# EAGLE design TSOC_CYBLE022 (EAGLE 6.6.0)
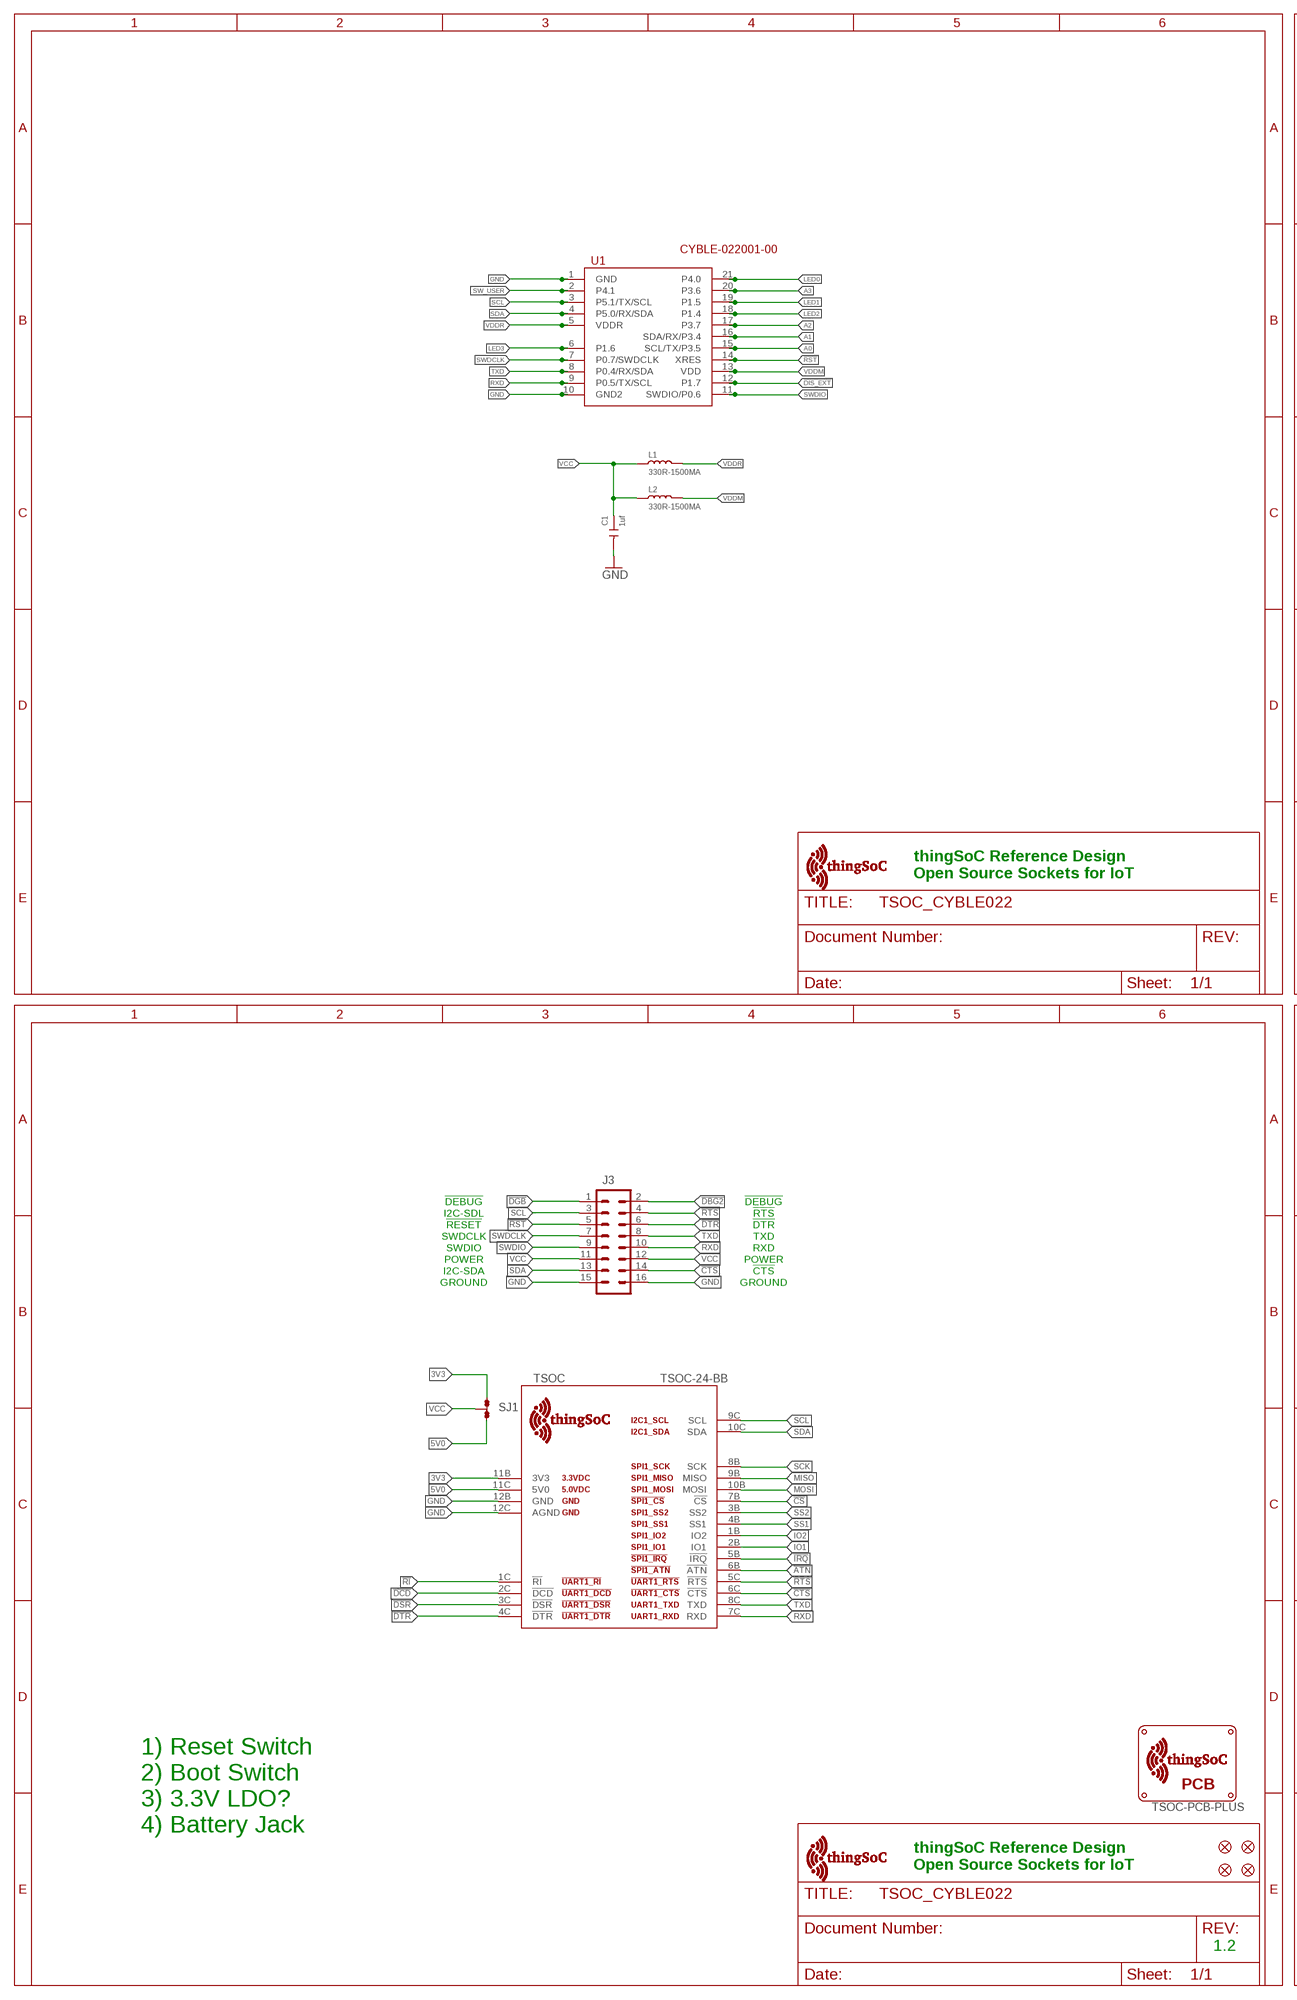
[diagram p0: schematic, sheet 1, part 1 of 2]
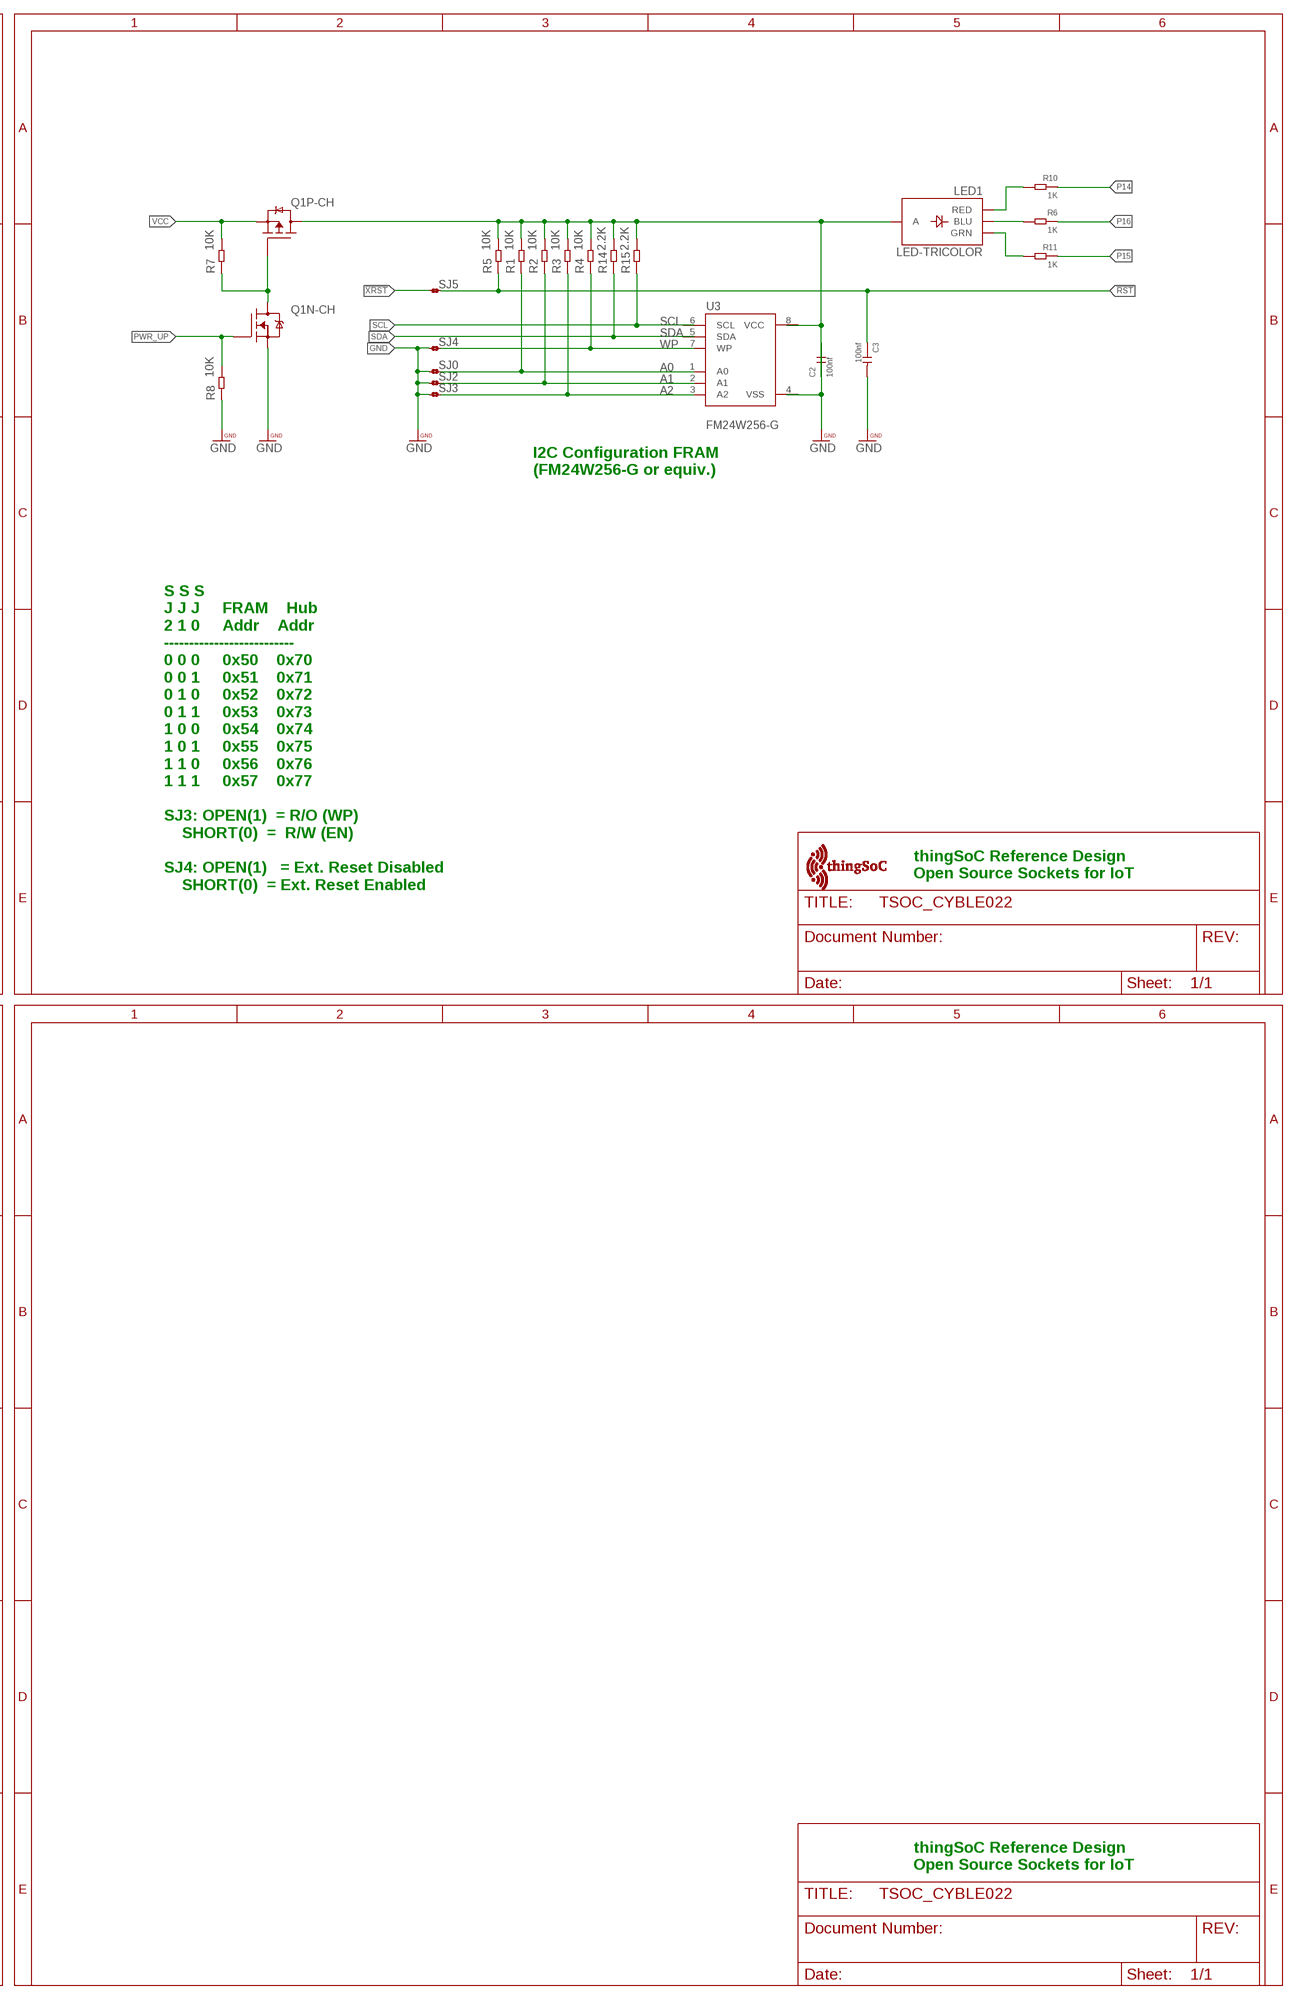
[diagram p1: schematic, sheet 1, part 2 of 2]

## Parts
$$U$4  TSOC-LOGO-SMALL  [TSOC-LOGO-SML]
C1  1uf  CERAMIC-1UF-25V-10%-X7R(0603)  [C0603]
C2  100nf  CERAMIC-100NF-50V-10%-X7R(0603)  [C0603]
C3  100nf  CERAMIC-100NF-50V-10%-X7R(0603)  [C0603]
FID1  FIDUCIALUFIDUCIAL  [MICRO-FIDUCIAL]
FID2  FIDUCIALUFIDUCIAL  [MICRO-FIDUCIAL]
FID3  FIDUCIALUFIDUCIAL  [MICRO-FIDUCIAL]
FID4  FIDUCIALUFIDUCIAL  [MICRO-FIDUCIAL]
J3  M08X2  [2X8]
L1  330R-1500MA  SMD-FERRITE-BEAD-330R-1500MA(0805)'0805'  [L0805]
L2  330R-1500MA  SMD-FERRITE-BEAD-330R-1500MA(0805)'0805'  [L0805]
LED1  LED-TRICOLOR  [LED-TRICOLOR-SMD]
Q1  FDC6420C  [SOT95P280X110-6N]
R1  10K  SMD-RES-10K-1%-1/10W(0603)  [R0603]
R2  10K  SMD-RES-10K-1%-1/10W(0603)  [R0603]
R3  10K  SMD-RES-10K-1%-1/10W(0603)  [R0603]
R4  10K  SMD-RES-10K-1%-1/10W(0603)  [R0603]
R5  10K  SMD-RES-10K-1%-1/10W(0603)  [R0603]
R6  1K  SMD-RES-1K-1%-1/10W(0603)  [R0603]
R7  10K  SMD-RES-10K-1%-1/10W(0603)  [R0603]
R8  10K  SMD-RES-10K-1%-1/10W(0603)  [R0603]
R10  1K  SMD-RES-1K-1%-1/10W(0603)  [R0603]
R11  1K  SMD-RES-1K-1%-1/10W(0603)  [R0603]
R14  2.2K  SMD-RES-2.2K-5%-1/10W(0603)  [R0603]
R15  2.2K  SMD-RES-2.2K-5%-1/10W(0603)  [R0603]
SJ0  JMP-2-NO  [JMP-2-NO]
SJ1  JMP-3-NC  [JMP-3-NC]
SJ2  JMP-2-NO  [JMP-2-NO]
SJ3  JMP-2-NO  [JMP-2-NO]
SJ4  JMP-2-NO  [JMP-2-NO]
SJ5  JMP-2-NO  [JMP-2-NO]
TSOC  TSOC-24-BB  [TSOC-BB-S24]
U1  CYBLE-022001-00  [PROC-BLE-10MM-21]
U3  FM24W256-G  [SO08]
U$1  TSOC-PCB-PLUS  [TSOC-BB-BRD-PLUS-DIM]
U$100  TSOC-LOGO-SMALL  [TSOC-LOGO-SML]
U$101  TSOC-LOGO-LRG  [TSOC-LOGO-LRG]

## Nets
3V3: SJ1.1 TSOC.11B(3V3)
5V0: SJ1.3 TSOC.11C(5V0)
!ATN: TSOC.6B(!ATN)
!CS: TSOC.7B(!CS)
!CTS: J3.14 TSOC.6C(!CTS)
!DBG2: J3.2
!DCD: TSOC.2C(!DCD)
!DGB: J3.1
!DIS_EXT: U1.12(P1.7)
!DSR: TSOC.3C(!DSR)
!DTR: J3.6 TSOC.4C(!DTR)
!IRQ: TSOC.5B(!IRQ)
!RI: TSOC.1C(!RI)
!RST: C3.1 J3.5 R5.1 SJ5.1 U1.14(XRES)
!RTS: J3.4 TSOC.5C(!RTS)
!XRST: SJ5.2
A0: R1.1 SJ0.2 U1.15(SCL/TX/P3.5) U3.1(A0)
A1: R2.1 SJ2.2 U1.16(SDA/RX/P3.4) U3.2(A1)
A2: R3.1 SJ3.2 U1.17(P3.7) U3.3(A2)
A3: U1.20(P3.6)
BLU: LED1.B(BLU) R6.2
GATE: Q1.3(P-CH:G) Q1.6(N-CH:D) R7.1
GND: C1.2 C2.2 C3.2 J3.15 J3.16 Q1.5(N-CH:S) R8.1 SJ0.1 SJ2.1 SJ3.1 SJ4.1 TSOC.12B(GND) TSOC.12C(AGND) U1.1(GND) U1.10(GND2) U3.4(VSS)
GRN: LED1.G(GRN) R11.2
IO1: TSOC.2B(IO1)
IO2: TSOC.1B(IO2)
LED0: U1.21(P4.0)
LED1: U1.19(P1.5)
LED2: U1.18(P1.4)
LED3: U1.6(P1.6)
MISO: TSOC.9B(MISO)
MOSI: TSOC.10B(MOSI)
P14: R10.1
P15: R11.1
P16: R6.1
PWR_UP: Q1.1(N-CH:G) R8.2
RED: LED1.R(RED) R10.2
RXD: J3.10 TSOC.7C(RXD) U1.9(P0.5/TX/SCL)
SCK: TSOC.8B(SCK)
SCL: J3.3 R15.1 TSOC.9C(SCL) U1.3(P5.1/TX/SCL) U3.6(SCL)
SDA: J3.13 R14.1 TSOC.10C(SDA) U1.4(P5.0/RX/SDA) U3.5(SDA)
SS1: TSOC.4B(SS1)
SS2: TSOC.3B(SS2)
SW_USER: U1.2(P4.1)
SWDCLK: J3.7 U1.7(P0.7/SWDCLK)
SWDIO: J3.9 U1.11(SWDIO/P0.6)
TXD: J3.8 TSOC.8C(TXD) U1.8(P0.4/RX/SDA)
VCC: C1.1 J3.11 J3.12 L1.1 L2.1 Q1.2(P-CH:S) R7.2 SJ1.2
VCC_PU: C2.1 LED1.A Q1.4(P-CH:D) R1.2 R2.2 R3.2 R4.2 R5.2 R14.2 R15.2 U3.8(VCC)
VDDM: L2.2 U1.13(VDD)
VDDR: L1.2 U1.5(VDDR)
WP: R4.1 SJ4.2 U3.7(WP)

## Notes on the sheet
- I2C Configuration FRAM
  (FM24W256-G or equiv.)
- thingSoC Reference Design
  Open Source Sockets for IoT
- thingSoC Reference Design
  Open Source Sockets for IoT
- S S S
  J J J     FRAM    Hub
  2 1 0     Addr    Addr
  --------------------------
  0 0 0     0x50    0x70
  0 0 1     0x51    0x71
  0 1 0     0x52    0x72
  0 1 1     0x53    0x73
  1 0 0     0x54    0x74
  1 0 1     0x55    0x75
  1 1 0     0x56    0x76
  1 1 1     0x57    0x77
  
  SJ3: OPEN(1)  = R/O (WP)
      SHORT(0)  =  R/W (EN)
  
  SJ4: OPEN(1)   = Ext. Reset Disabled
      SHORT(0)  = Ext. Reset Enabled
- !DEBUG | !DEBUG
- I2C-SDL | !RTS
- !RESET | !DTR
- SWDCLK | TXD
- SWDIO | RXD
- POWER | POWER
- I2C-SDA | !CTS
- GROUND | GROUND
- 1) Reset Switch
  2) Boot Switch
  3) 3.3V LDO?
  4) Battery Jack
- thingSoC Reference Design
  Open Source Sockets for IoT
- thingSoC Reference Design
  Open Source Sockets for IoT
- 1.2

## Library data of the parts
$$U$4 U$100 U$101 = thingSoC:TSOC-LOGO: thingSoC Logo Source LBR : http://www.thingsoc.com Github : https://github.com/thingsoc License : http://creativecommons.org/licenses/by-sa/4.0/ (Creative Commons 4.0) THIS SOFTWARE IS PROVIDED BY THE CONTRIBUTORS "AS IS" AND WITHOUT ANY EXPRESS OR IMPLIED WARRANTIES, INCLUDING, BUT NOT LIMITED TO, THE IMPLIED WARRANTIES OF MERCHANTABILITY AND FITNESS FOR A PARTICULAR PURPOSE ARE DISCLAIMED. IN NO EVENT SHALL THE COPYRIGHT OWNER OR CONTRIBUTORS BE LIABLE FOR ANY DIRECT, INDIRECT, INCIDENTAL, SPECIAL, EXEMPLARY, OR CONSEQUENTIAL DAMAGES (INCLUDING, BUT NOT LIMITED TO, PROCUREMENT OF SUBSTITUTE GOODS OR SERVICES; LOSS OF USE, DATA, OR PROFITS; OR BUSINESS INTERRUPTION) HOWEVER CAUSED AND ON ANY THEORY OF LIABILITY, WHETHER IN CONTRACT, STRICT LIABILITY, OR TORT (INCLUDING NEGLIGENCE OR OTHERWISE) ARISING IN ANY WAY OUT OF THE USE OF THIS SOFTWARE, EVEN IF ADVISED OF THE POSSIBILITY OF SUCH DAMAGE.
C1 = Seeed-Capacitor-2016:CERAMIC-1UF-25V-10%-X7R(0603): 302010139; MPN: CC0603KRX7R8BB105
C2 C3 = Seeed-Capacitor-2016:CERAMIC-100NF-50V-10%-X7R(0603): 302010138; MPN: CC0603KRX7R9BB104
FID1-FID4 = TSOC-ESP8266-BASE:FIDUCIAL: Fiducial Alignment Points Various fiducial points for machine vision alignment.
J3 = PatternAgents-ProtoPads:M08X2: .1" headers, two rows of 8 each
L1 L2 = Seeed-Inductor-2016:SMD-FERRITE-BEAD-330R-1500MA(0805): 303030006; MPN: BLM21PG331SN1D
LED1 = SparkFun-LED:LED-TRICOLOR: Tri-Color LED SMD Proven layout and schematic for triple color LED in SMD package - common anode. Spark Fun Electronics SKU : COM-07844
Q1 = PatternAgents-Fairchild:FDC6420C: N and P Channel Power Trench MOSFETs
R1-R5 R7 R8 = Seeed-Resistor-2016:SMD-RES-10K-1%-1/10W(0603): 301010299; MPN: RC0603FR-0710KL
R6 R10 R11 = Seeed-Resistor-2016:SMD-RES-1K-1%-1/10W(0603): 301010298; MPN: RC0603FR-071KL
R14 R15 = Seeed-Resistor-2016:SMD-RES-2.2K-5%-1/10W(0603): 301010124; MPN: RC0603JR-072K2L
SJ0 SJ2-SJ5 = scratch-ProtoPads:JMP-2-NO: Basic Jumper - Normally Open Positions 1 and 2 are normally NOT connected. PatternAgents ProtoPads Library Schematic and PCB layout libraries for design patterns by PatternAgents. For the CADSoft Eagle CAD program : http://www.cadsoftusa.com/download-eagle/ Source LBR : http://www.patternagents.com Github : https://github.com/PatternAgents License : http://creativecommons.org/licenses/by-sa/4.0/ (Creative Commons 4.0) THIS SOFTWARE IS PROVIDED BY THE CONTRIBUTORS "AS IS" AND WITHOUT ANY EXPRESS OR IMPLIED WARRANTIES, INCLUDING, BUT NOT LIMITED TO, THE IMPLIED WARRANTIES OF MERCHANTABILITY AND FITNESS FOR A PARTICULAR PURPOSE ARE DISCLAIMED. IN NO EVENT SHALL THE COPYRIGHT OWNER OR CONTRIBUTORS BE LIABLE FOR ANY DIRECT, INDIRECT, INCIDENTAL, SPECIAL, EXEMPLARY, OR CONSEQUENTIAL DAMAGES (INCLUDING, BUT NOT LIMITED TO, PROCUREMENT OF SUBSTITUTE GOODS OR SERVICES; LOSS OF USE, DATA, OR PROFITS; OR BUSINESS INTERRUPTION) HOWEVER CAUSED AND ON ANY THEORY OF LIABILITY, WHETHER IN CONTRACT, STRICT LIABILITY, OR TORT (INCLUDING NEGLIGENCE OR OTHERWISE) ARISING IN ANY WAY OUT OF THE USE OF THIS SOFTWARE, EVEN IF ADVISED OF THE POSSIBILITY OF SUCH DAMAGE.; BOM: EXCLUDE
SJ1 = PatternAgents-ProtoPads:JMP-3-NC: Three Terminal Jumper - ALL Connected Positions 1, 2, and 3 are normally connected. PatternAgents ProtoPads Library Schematic and PCB layout libraries for design patterns by PatternAgents. For the CADSoft Eagle CAD program : http://www.cadsoftusa.com/download-eagle/ Source LBR : http://www.patternagents.com Github : https://github.com/PatternAgents License : http://creativecommons.org/licenses/by-sa/4.0/ (Creative Commons 4.0) THIS SOFTWARE IS PROVIDED BY THE CONTRIBUTORS "AS IS" AND WITHOUT ANY EXPRESS OR IMPLIED WARRANTIES, INCLUDING, BUT NOT LIMITED TO, THE IMPLIED WARRANTIES OF MERCHANTABILITY AND FITNESS FOR A PARTICULAR PURPOSE ARE DISCLAIMED. IN NO EVENT SHALL THE COPYRIGHT OWNER OR CONTRIBUTORS BE LIABLE FOR ANY DIRECT, INDIRECT, INCIDENTAL, SPECIAL, EXEMPLARY, OR CONSEQUENTIAL DAMAGES (INCLUDING, BUT NOT LIMITED TO, PROCUREMENT OF SUBSTITUTE GOODS OR SERVICES; LOSS OF USE, DATA, OR PROFITS; OR BUSINESS INTERRUPTION) HOWEVER CAUSED AND ON ANY THEORY OF LIABILITY, WHETHER IN CONTRACT, STRICT LIABILITY, OR TORT (INCLUDING NEGLIGENCE OR OTHERWISE) ARISING IN ANY WAY OUT OF THE USE OF THIS SOFTWARE, EVEN IF ADVISED OF THE POSSIBILITY OF SUCH DAMAGE.; BOM: EXCLUDE
TSOC = thingSoC:TSOC-24: thingSoC Twenty-Four(24) Pin Socket Source LBR : http://www.thingsoc.com Github : https://github.com/thingsoc License : http://creativecommons.org/licenses/by-sa/4.0/ (Creative Commons 4.0) THIS SOFTWARE IS PROVIDED BY THE CONTRIBUTORS "AS IS" AND WITHOUT ANY EXPRESS OR IMPLIED WARRANTIES, INCLUDING, BUT NOT LIMITED TO, THE IMPLIED WARRANTIES OF MERCHANTABILITY AND FITNESS FOR A PARTICULAR PURPOSE ARE DISCLAIMED. IN NO EVENT SHALL THE COPYRIGHT OWNER OR CONTRIBUTORS BE LIABLE FOR ANY DIRECT, INDIRECT, INCIDENTAL, SPECIAL, EXEMPLARY, OR CONSEQUENTIAL DAMAGES (INCLUDING, BUT NOT LIMITED TO, PROCUREMENT OF SUBSTITUTE GOODS OR SERVICES; LOSS OF USE, DATA, OR PROFITS; OR BUSINESS INTERRUPTION) HOWEVER CAUSED AND ON ANY THEORY OF LIABILITY, WHETHER IN CONTRACT, STRICT LIABILITY, OR TORT (INCLUDING NEGLIGENCE OR OTHERWISE) ARISING IN ANY WAY OUT OF THE USE OF THIS SOFTWARE, EVEN IF ADVISED OF THE POSSIBILITY OF SUCH DAMAGE.
U1 = PatternAgents-Cypress:CYBLE-022001-00: Cypress PSoC® 4 - Programmable System on Chip, Cortex-M0 Based , Bluetooth Radio Module http://www.cypress.com/?mpn=CYBLE-022001-00 LBR Source: http://www.patternagents.com THIS SOFTWARE IS PROVIDED BY THE CONTRIBUTORS "AS IS" AND WITHOUT ANY EXPRESS OR IMPLIED WARRANTIES, INCLUDING, BUT NOT LIMITED TO, THE IMPLIED WARRANTIES OF MERCHANTABILITY AND FITNESS FOR A PARTICULAR PURPOSE ARE DISCLAIMED. IN NO EVENT SHALL THE COPYRIGHT OWNER OR CONTRIBUTORS BE LIABLE FOR ANY DIRECT, INDIRECT, INCIDENTAL, SPECIAL, EXEMPLARY, OR CONSEQUENTIAL DAMAGES (INCLUDING, BUT NOT LIMITED TO, PROCUREMENT OF SUBSTITUTE GOODS OR SERVICES; LOSS OF USE, DATA, OR PROFITS; OR BUSINESS INTERRUPTION) HOWEVER CAUSED AND ON ANY THEORY OF LIABILITY, WHETHER IN CONTRACT, STRICT LIABILITY, OR TORT (INCLUDING NEGLIGENCE OR OTHERWISE) ARISING IN ANY WAY OUT OF THE USE OF THIS SOFTWARE, EVEN IF ADVISED OF THE POSSIBILITY OF SUCH DAMAGE.
U3 = PatternAgents-Cypress:FM24W256: I2C FRAM FM24W256
U$1 = thingSoC:TSOC-PCB: thingSoC PCB Outlines Boards Outlines for Standard Sizes (in the DImension Layer) (Registration marks in the tDocu layer - make sure to turn on tDocu/bDocu) Source LBR : http://www.thingsoc.com Github : https://github.com/thingsoc License : http://creativecommons.org/licenses/by-sa/4.0/ (Creative Commons 4.0) THIS SOFTWARE IS PROVIDED BY THE CONTRIBUTORS "AS IS" AND WITHOUT ANY EXPRESS OR IMPLIED WARRANTIES, INCLUDING, BUT NOT LIMITED TO, THE IMPLIED WARRANTIES OF MERCHANTABILITY AND FITNESS FOR A PARTICULAR PURPOSE ARE DISCLAIMED. IN NO EVENT SHALL THE COPYRIGHT OWNER OR CONTRIBUTORS BE LIABLE FOR ANY DIRECT, INDIRECT, INCIDENTAL, SPECIAL, EXEMPLARY, OR CONSEQUENTIAL DAMAGES (INCLUDING, BUT NOT LIMITED TO, PROCUREMENT OF SUBSTITUTE GOODS OR SERVICES; LOSS OF USE, DATA, OR PROFITS; OR BUSINESS INTERRUPTION) HOWEVER CAUSED AND ON ANY THEORY OF LIABILITY, WHETHER IN CONTRACT, STRICT LIABILITY, OR TORT (INCLUDING NEGLIGENCE OR OTHERWISE) ARISING IN ANY WAY OUT OF THE USE OF THIS SOFTWARE, EVEN IF ADVISED OF THE POSSIBILITY OF SUCH DAMAGE.

## Board
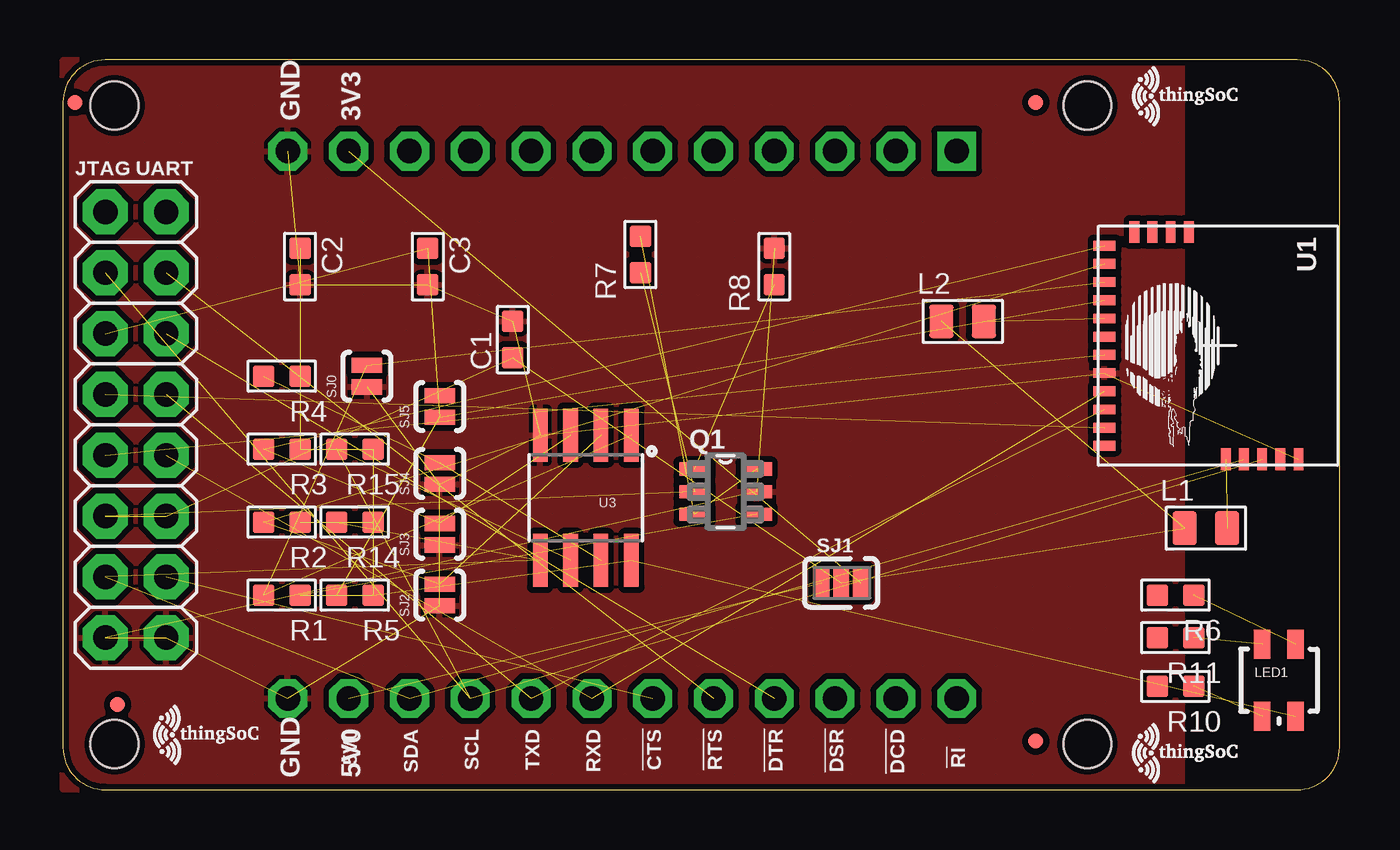
[diagram p2: board, top side]
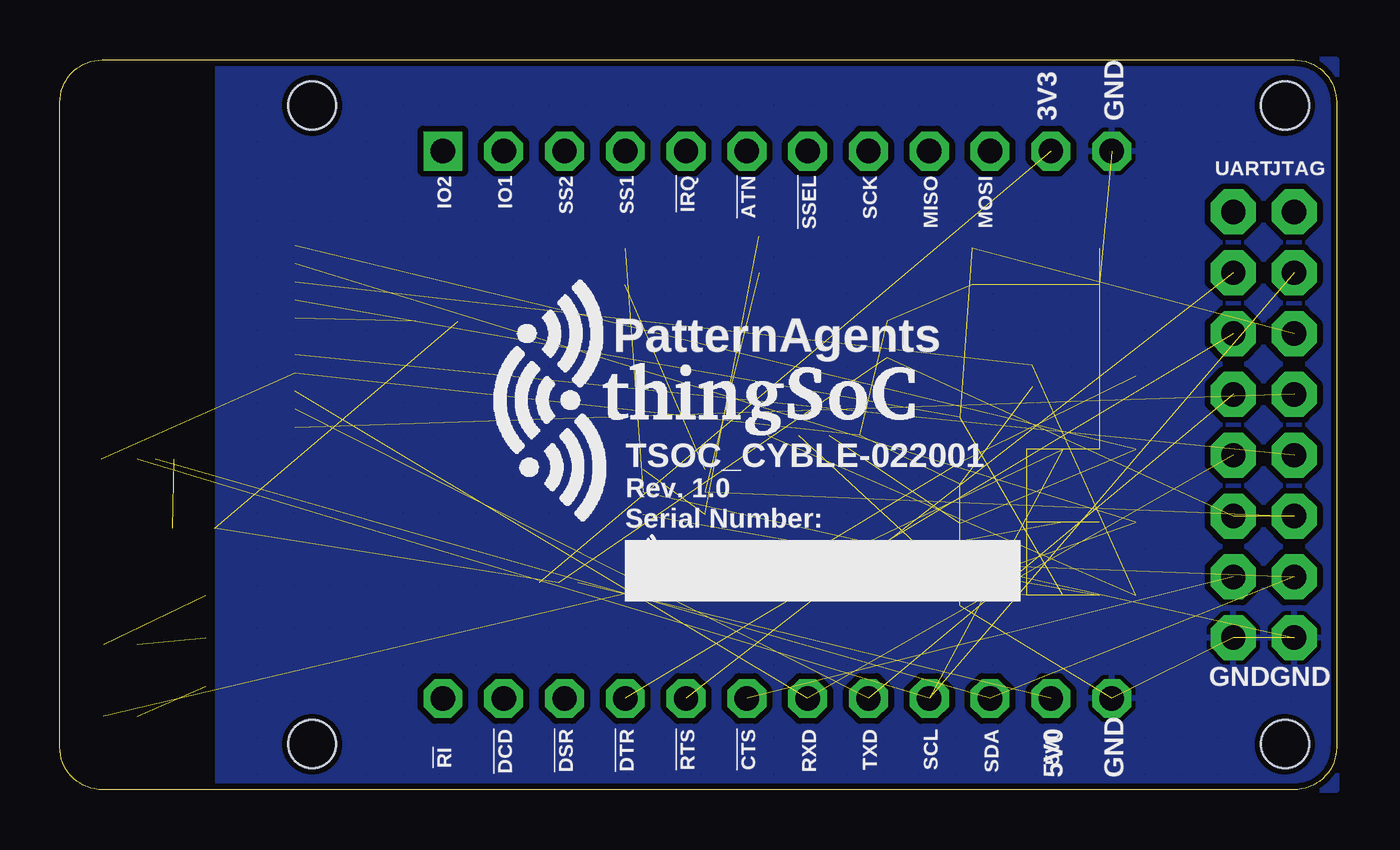
[diagram p3: board, bottom side, seen from below]

Size 53.34 x 30.48 mm. Coordinates in mm from the lower left corner, seen from the top.
Copper layers (1*16): Top 0.035mm / dielectric 1.5mm / Bottom 0.035mm
Design rules "PatternAgents_7mil": minimum track width 7mil, minimum drill 14mil, track to track 7mil, track to pad 7mil, pad to pad 7mil, via to via 7mil, smd to smd 7mil, copper to edge 7mil, drill to drill 7mil, minimum pad ring 12mil, minimum via ring 10mil, stop-mask expansion 4mil, vias tented up to drill 25mil, thermal gap 7mil

### Footprints (pad centres in the part's own frame; a part is rotated, then mirrored left to right if it is on the bottom)
C0603 = smd 0.889 x 0.889: 1 0,0.762; 2 0,-0.762
MICRO-FIDUCIAL = smd 0.635 x 0.635: 1 0,0
2X8 = drill 1.016 pad 1.88 octagon: 1 0,0; 2 0,2.54; 3 2.54,0; 4 2.54,2.54; 5 5.08,0; 6 5.08,2.54; 7 7.62,0; 8 7.62,2.54; 9 10.16,0; 10 10.16,2.54; 11 12.7,0; 12 12.7,2.54; 13 15.24,0; 14 15.24,2.54; 15 17.78,0; 16 17.78,2.54
L0805 = smd 1.016 x 1.397: 1 -0.889,0; 2 0.889,0
LED-TRICOLOR-SMD = smd 0.7 x 1.2: A 0.7,-1.5; B 0.7,1.5; G -0.7,1.5; R -0.7,-1.5
SOT95P280X110-6N = smd 1.27 x 0.559: 1 -1.295,0.94; 2 -1.295,0; 3 -1.295,-0.94; 4 1.295,-0.94; 5 1.295,0; 6 1.295,0.94
R0603 = smd 0.889 x 0.889: 1 0,0.762; 2 0,-0.762
JMP-2-NO = smd 0.635 x 1.27: 1 -0.45,0; 2 0.45,0
JMP-3-NC = smd 0.635 x 1.27: 1 -0.813,0; 2 0,0; 3 0.813,0
TSOC-BB-S24 = drill 1.016 square: 1B -11.43,11.43 | drill 1.016 octagon: 1C 11.43,11.43; 2B -11.43,8.89; 2C 11.43,8.89; 3B -11.43,6.35; 3C 11.43,6.35; 4B -11.43,3.81; 4C 11.43,3.81; 5B -11.43,1.27; 5C 11.43,1.27; 6B -11.43,-1.27; 6C 11.43,-1.27; 7B -11.43,-3.81; 7C 11.43,-3.81; 8B -11.43,-6.35; 8C 11.43,-6.35; 9B -11.43,-8.89; 9C 11.43,-8.89; 10B -11.43,-11.43; 10C 11.43,-11.43; 11B -11.43,-13.97; 11C 11.43,-13.97; 12B -11.43,-16.51; 12C 11.43,-16.51
PROC-BLE-10MM-21 = smd 0.91 x 0.41: 1 4.745,3.36; 2 4.745,2.6; 3 4.745,1.84; 4 4.745,1.08; 5 4.745,0.32; 18 -4.745,-3.5; 19 -4.745,-2.74; 20 -4.745,-1.98; 21 -4.745,-1.22 | smd 0.41 x 0.91: 6 4.18,-4.745; 7 3.42,-4.745; 8 2.66,-4.745; 9 1.9,-4.745; 10 1.14,-4.745; 11 0.38,-4.745; 12 -0.38,-4.745; 13 -1.14,-4.745; 14 -1.9,-4.745; 15 -2.66,-4.745; 16 -3.42,-4.745; 17 -4.18,-4.745
SO08 = smd 0.61 x 2.21: 1 -1.905,-2.616; 2 -0.635,-2.616; 3 0.635,-2.616; 4 1.905,-2.616; 5 1.905,2.616; 6 0.635,2.616; 7 -0.635,2.616; 8 -1.905,2.616
TSOC-BB-BRD-PLUS-DIM = hole 2: -13.335,-23.749; 13.335,-23.749; -13.335,16.891; 13.335,16.891

### Placement (x,y rotation side)
$$U$1  TSOC-LOGO-SMALL  [TSOC-LOGO-SML]  4.57,2.29 0 top
$$U$3  TSOC-LOGO-SMALL  [TSOC-LOGO-SML]  45.47,28.96 0 top
$$U$4  45.47,1.52 0 top
C1  18.8,18.8 180 top
C2  9.91,21.84 0 top
C3  15.24,21.84 0 top
FID1  2.29,3.56 0 top
FID2  0.51,28.7 0 top
FID3  40.64,28.7 0 top
FID4  40.64,2.03 0 top
J3  1.78,24.13 270 top
L1  47.75,10.92 0 top
L2  37.59,19.56 0 top
LED1  50.8,4.57 0 top
Q1  27.69,12.45 0 top
R1  9.14,8.13 90 top
R2  9.14,11.18 90 top
R3  9.14,14.22 90 top
R4  9.14,17.27 90 top
R5  12.19,8.13 90 top
R6  46.48,8.13 90 top
R7  24.13,22.35 0 top
R8  29.72,21.84 0 top
R10  46.48,4.32 90 top
R11  46.48,6.35 90 top
R14  12.19,11.18 90 top
R15  12.19,14.22 90 top
SJ0  12.7,17.27 90 top
SJ1  32.51,8.64 180 top
SJ2  15.75,8.13 90 top
SJ3  15.75,10.67 90 top
SJ4  15.75,13.21 90 top
SJ5  15.75,16 90 top
TSOC  25.91,15.24 270 top
U1  48.26,18.54 270 top
U3  21.84,12.19 180 top
U$1  25.91,15.24 270 top
U$100  28.7,9.4 0 bottom
U$101  32,16.26 0 bottom

### Tracks (layer width: path | path; a pad name or v marks a point on that pad's centre or on a via)
3V3  (1 unrouted)
5V0  (1 unrouted)
!CTS  (1 unrouted)
!DTR  (1 unrouted)
!RST  (4 unrouted)
!RTS  (1 unrouted)
A0  (3 unrouted)
A1  (3 unrouted)
A2  (3 unrouted)
BLU  (1 unrouted)
GATE  (2 unrouted)
GND  (15 unrouted)
  pour Top (isolate 0.254, hatched): 0,0 0,30.48 46.74,30.48 46.74,0
  pour Bottom (isolate 0.254, hatched): 0,0 0,30.48 46.74,30.48 46.74,0
GRN  (1 unrouted)
PWR_UP  (1 unrouted)
RED  (1 unrouted)
RXD  (2 unrouted)
SCL  (4 unrouted)
SDA  (4 unrouted)
SWDCLK  (1 unrouted)
SWDIO  (1 unrouted)
TXD  (2 unrouted)
VCC  (7 unrouted)
VCC_PU  (10 unrouted)
VDDM  (1 unrouted)
VDDR  (1 unrouted)
WP  (2 unrouted)

### Text on the board
tPlace: GND | 3V3 | JTAG | UART | 5V0 | SDA | SCL | TXD | RXD | !CTS | !RTS | !DTR | !DSR | !DCD | !RI | GND | 5V0
bPlace: GND | 3V3 | JTAG | UART | MOSI | MISO | SCK | !SSEL | !ATN | !IRQ | SS1 | SS2 | IO1 | IO2 | PatternAgents | TSOC_CYBLE-022001 | Rev. 1.0 | Serial Number: | GND | GND | 5V0 | SDA | SCL | TXD | RXD | !CTS | !RTS | !DTR | !DSR | !DCD | !RI | GND | 5V0